# Altium schematic sheet Sheet4.SchDoc: Memory ICs
size B; DocumentNumber: 4; SheetNumber: 4; SheetTotal: 5
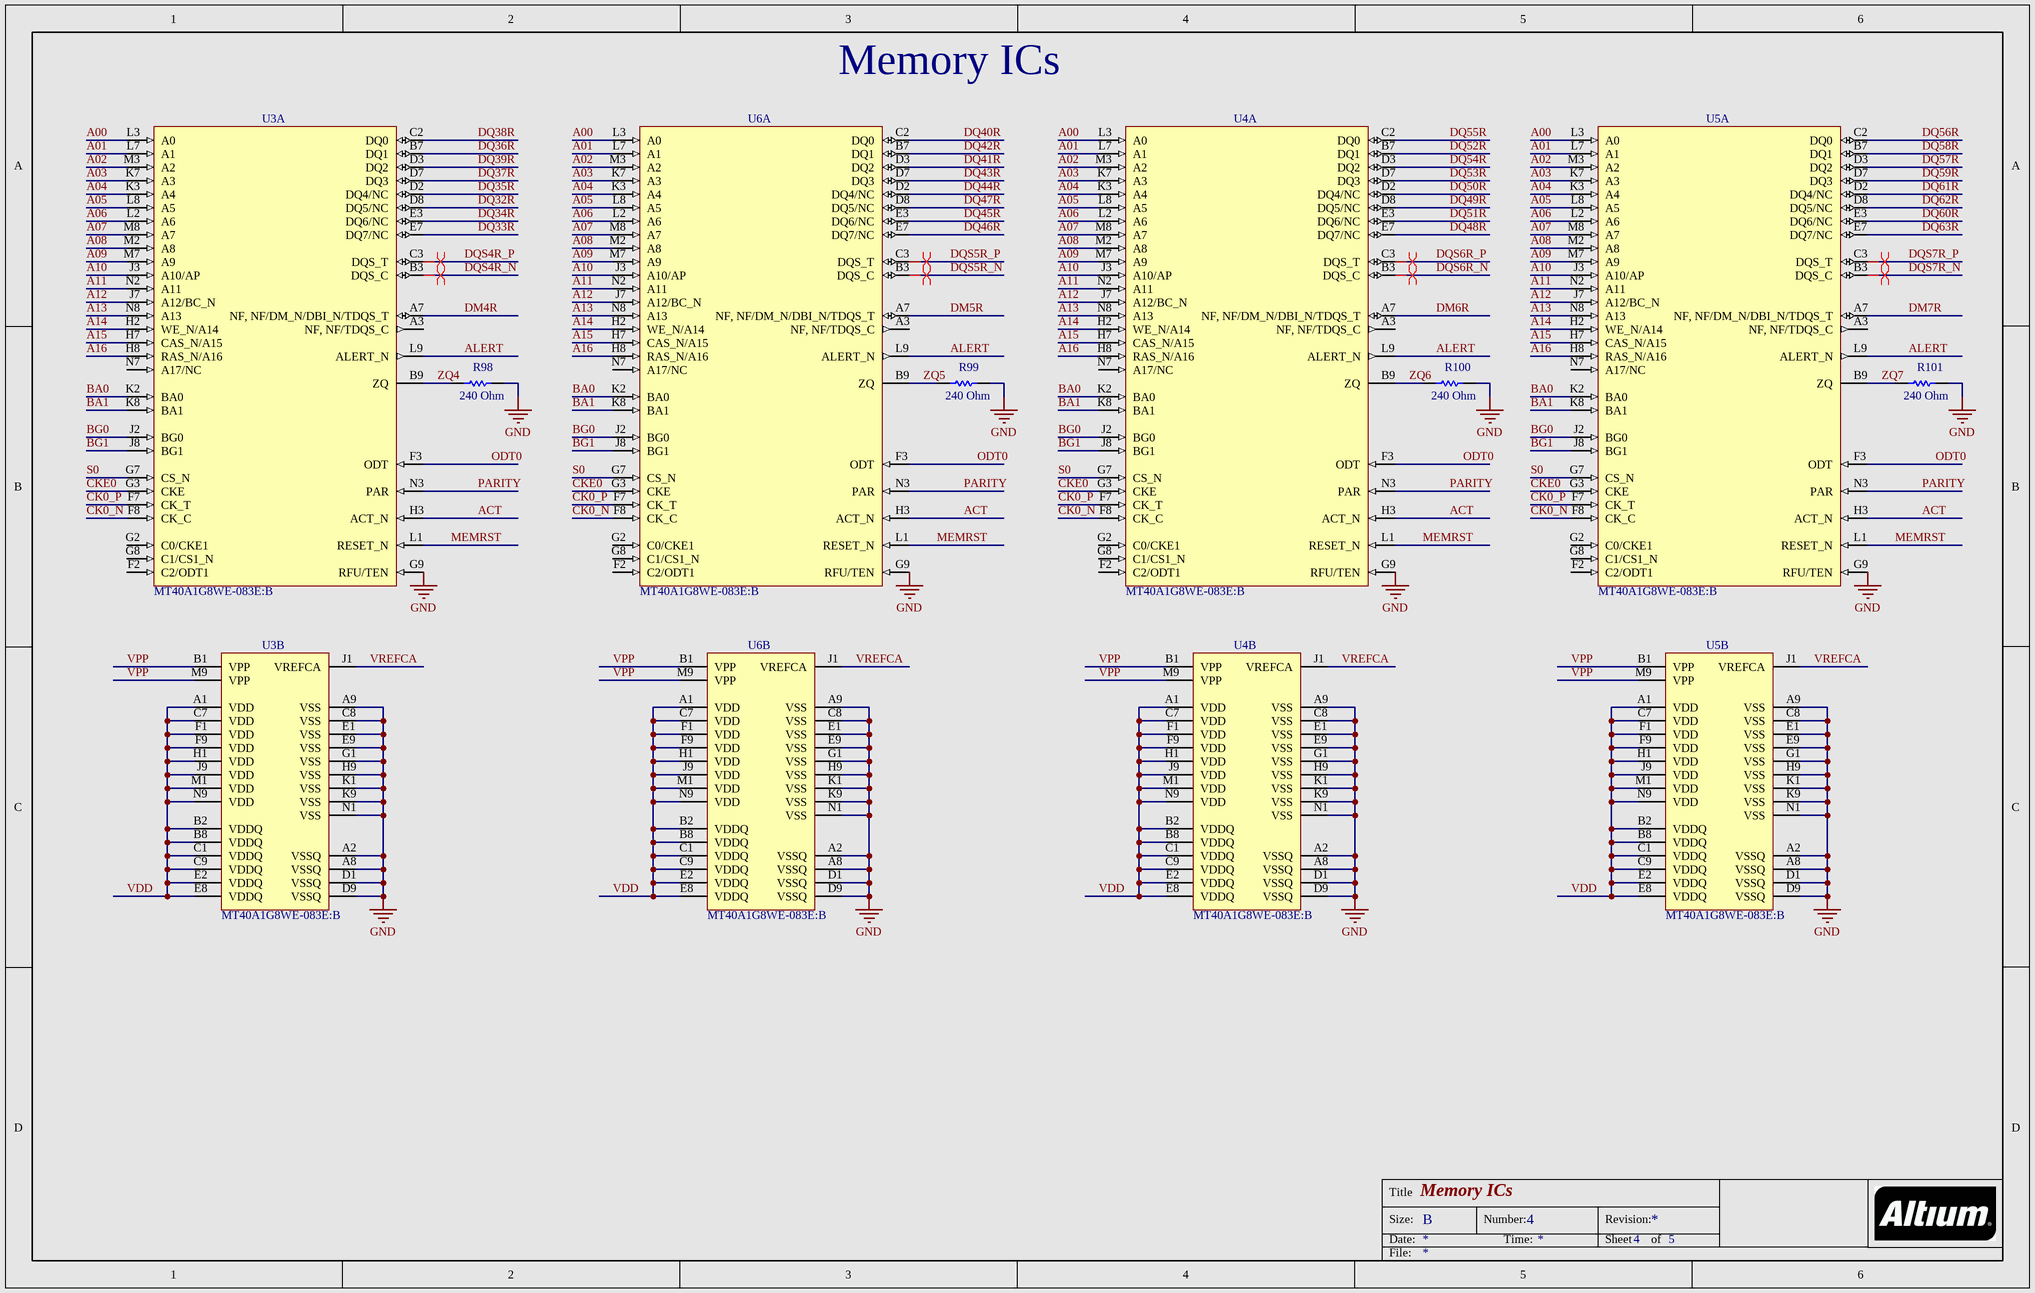
[diagram p0: Sheet4.SchDoc]

## Parts
R98  Resistance: 240 Ohm  [RESC1005X40X25ML05T05]  (hidden comment: ERJ-2GEJ241x)
R99  Resistance: 240 Ohm  [RESC1005X40X25ML05T05]  (hidden comment: ERJ-2GEJ241x)
R100  Resistance: 240 Ohm  [RESC1005X40X25ML05T05]  (hidden comment: ERJ-2GEJ241x)
R101  Resistance: 240 Ohm  [RESC1005X40X25ML05T05]  (hidden comment: ERJ-2GEJ241x)
U3  MT40A1G8WE-083E:B  [MICT-WE-78]  (parts A,B of 2)
U4  MT40A1G8WE-083E:B  [MICT-WE-78]  (parts A,B of 2)
U5  MT40A1G8WE-083E:B  [MICT-WE-78]  (parts A,B of 2)
U6  MT40A1G8WE-083E:B  [MICT-WE-78]  (parts A,B of 2)

## Nets
GND: R98.1 R99.1 R100.1 R101.1 U3.A2(VSSQ) U3.A8(VSSQ) U3.A9(VSS) U3.C8(VSS) U3.D1(VSSQ) U3.D9(VSSQ) U3.E1(VSS) U3.E9(VSS) U3.G1(VSS) U3.G9(RFU/TEN) U3.H9(VSS) U3.K1(VSS) U3.K9(VSS) U3.N1(VSS) U4.A2(VSSQ) U4.A8(VSSQ) U4.A9(VSS) U4.C8(VSS) U4.D1(VSSQ) U4.D9(VSSQ) U4.E1(VSS) U4.E9(VSS) U4.G1(VSS) U4.G9(RFU/TEN) U4.H9(VSS) U4.K1(VSS) U4.K9(VSS) U4.N1(VSS) U5.A2(VSSQ) U5.A8(VSSQ) U5.A9(VSS) U5.C8(VSS) U5.D1(VSSQ) U5.D9(VSSQ) U5.E1(VSS) U5.E9(VSS) U5.G1(VSS) U5.G9(RFU/TEN) U5.H9(VSS) U5.K1(VSS) U5.K9(VSS) U5.N1(VSS) U6.A2(VSSQ) U6.A8(VSSQ) U6.A9(VSS) U6.C8(VSS) U6.D1(VSSQ) U6.D9(VSSQ) U6.E1(VSS) U6.E9(VSS) U6.G1(VSS) U6.G9(RFU/TEN) U6.H9(VSS) U6.K1(VSS) U6.K9(VSS) U6.N1(VSS)
A00: U3.L3(A0) U4.L3(A0) U5.L3(A0) U6.L3(A0)
A01: U3.L7(A1) U4.L7(A1) U5.L7(A1) U6.L7(A1)
A02: U3.M3(A2) U4.M3(A2) U5.M3(A2) U6.M3(A2)
A03: U3.K7(A3) U4.K7(A3) U5.K7(A3) U6.K7(A3)
A04: U3.K3(A4) U4.K3(A4) U5.K3(A4) U6.K3(A4)
A05: U3.L8(A5) U4.L8(A5) U5.L8(A5) U6.L8(A5)
A06: U3.L2(A6) U4.L2(A6) U5.L2(A6) U6.L2(A6)
A07: U3.M8(A7) U4.M8(A7) U5.M8(A7) U6.M8(A7)
A08: U3.M2(A8) U4.M2(A8) U5.M2(A8) U6.M2(A8)
A09: U3.M7(A9) U4.M7(A9) U5.M7(A9) U6.M7(A9)
A10: U3.J3(A10/AP) U4.J3(A10/AP) U5.J3(A10/AP) U6.J3(A10/AP)
A11: U3.N2(A11) U4.N2(A11) U5.N2(A11) U6.N2(A11)
A12: U3.J7(A12/BC_N) U4.J7(A12/BC_N) U5.J7(A12/BC_N) U6.J7(A12/BC_N)
A13: U3.N8(A13) U4.N8(A13) U5.N8(A13) U6.N8(A13)
A14: U3.H2(WE_N/A14) U4.H2(WE_N/A14) U5.H2(WE_N/A14) U6.H2(WE_N/A14)
A15: U3.H7(CAS_N/A15) U4.H7(CAS_N/A15) U5.H7(CAS_N/A15) U6.H7(CAS_N/A15)
A16: U3.H8(RAS_N/A16) U4.H8(RAS_N/A16) U5.H8(RAS_N/A16) U6.H8(RAS_N/A16)
ACT: U3.H3(ACT_N) U4.H3(ACT_N) U5.H3(ACT_N) U6.H3(ACT_N)
ALERT: U3.L9(ALERT_N) U4.L9(ALERT_N) U5.L9(ALERT_N) U6.L9(ALERT_N)
BA0: U3.K2(BA0) U4.K2(BA0) U5.K2(BA0) U6.K2(BA0)
BA1: U3.K8(BA1) U4.K8(BA1) U5.K8(BA1) U6.K8(BA1)
BG0: U3.J2(BG0) U4.J2(BG0) U5.J2(BG0) U6.J2(BG0)
BG1: U3.J8(BG1) U4.J8(BG1) U5.J8(BG1) U6.J8(BG1)
CK0_N: U3.F8(CK_C) U4.F8(CK_C) U5.F8(CK_C) U6.F8(CK_C)
CK0_P: U3.F7(CK_T) U4.F7(CK_T) U5.F7(CK_T) U6.F7(CK_T)
CKE0: U3.G3(CKE) U4.G3(CKE) U5.G3(CKE) U6.G3(CKE)
DM4R: U3.A7(NF,_NF/DM_N/DBI_N/TDQS_T)
DM5R: U6.A7(NF,_NF/DM_N/DBI_N/TDQS_T)
DM6R: U4.A7(NF,_NF/DM_N/DBI_N/TDQS_T)
DM7R: U5.A7(NF,_NF/DM_N/DBI_N/TDQS_T)
DQ32R: U3.D8(DQ5/NC)
DQ33R: U3.E7(DQ7/NC)
DQ34R: U3.E3(DQ6/NC)
DQ35R: U3.D2(DQ4/NC)
DQ36R: U3.B7(DQ1)
DQ37R: U3.D7(DQ3)
DQ38R: U3.C2(DQ0)
DQ39R: U3.D3(DQ2)
DQ40R: U6.C2(DQ0)
DQ41R: U6.D3(DQ2)
DQ42R: U6.B7(DQ1)
DQ43R: U6.D7(DQ3)
DQ44R: U6.D2(DQ4/NC)
DQ45R: U6.E3(DQ6/NC)
DQ46R: U6.E7(DQ7/NC)
DQ47R: U6.D8(DQ5/NC)
DQ48R: U4.E7(DQ7/NC)
DQ49R: U4.D8(DQ5/NC)
DQ50R: U4.D2(DQ4/NC)
DQ51R: U4.E3(DQ6/NC)
DQ52R: U4.B7(DQ1)
DQ53R: U4.D7(DQ3)
DQ54R: U4.D3(DQ2)
DQ55R: U4.C2(DQ0)
DQ56R: U5.C2(DQ0)
DQ57R: U5.D3(DQ2)
DQ58R: U5.B7(DQ1)
DQ59R: U5.D7(DQ3)
DQ60R: U5.E3(DQ6/NC)
DQ61R: U5.D2(DQ4/NC)
DQ62R: U5.D8(DQ5/NC)
DQ63R: U5.E7(DQ7/NC)
DQS4R_N: U3.B3(DQS_C)
DQS4R_P: U3.C3(DQS_T)
DQS5R_N: U6.B3(DQS_C)
DQS5R_P: U6.C3(DQS_T)
DQS6R_N: U4.B3(DQS_C)
DQS6R_P: U4.C3(DQS_T)
DQS7R_N: U5.B3(DQS_C)
DQS7R_P: U5.C3(DQS_T)
MEMRST: U3.L1(RESET_N) U4.L1(RESET_N) U5.L1(RESET_N) U6.L1(RESET_N)
ODT0: U3.F3(ODT) U4.F3(ODT) U5.F3(ODT) U6.F3(ODT)
PARITY: U3.N3(PAR) U4.N3(PAR) U5.N3(PAR) U6.N3(PAR)
S0: U3.G7(CS_N) U4.G7(CS_N) U5.G7(CS_N) U6.G7(CS_N)
VDD: U3.A1(VDD) U3.B2(VDDQ) U3.B8(VDDQ) U3.C1(VDDQ) U3.C7(VDD) U3.C9(VDDQ) U3.E2(VDDQ) U3.E8(VDDQ) U3.F1(VDD) U3.F9(VDD) U3.H1(VDD) U3.J9(VDD) U3.M1(VDD) U3.N9(VDD) U4.A1(VDD) U4.B2(VDDQ) U4.B8(VDDQ) U4.C1(VDDQ) U4.C7(VDD) U4.C9(VDDQ) U4.E2(VDDQ) U4.E8(VDDQ) U4.F1(VDD) U4.F9(VDD) U4.H1(VDD) U4.J9(VDD) U4.M1(VDD) U4.N9(VDD) U5.A1(VDD) U5.B2(VDDQ) U5.B8(VDDQ) U5.C1(VDDQ) U5.C7(VDD) U5.C9(VDDQ) U5.E2(VDDQ) U5.E8(VDDQ) U5.F1(VDD) U5.F9(VDD) U5.H1(VDD) U5.J9(VDD) U5.M1(VDD) U5.N9(VDD) U6.A1(VDD) U6.B2(VDDQ) U6.B8(VDDQ) U6.C1(VDDQ) U6.C7(VDD) U6.C9(VDDQ) U6.E2(VDDQ) U6.E8(VDDQ) U6.F1(VDD) U6.F9(VDD) U6.H1(VDD) U6.J9(VDD) U6.M1(VDD) U6.N9(VDD)
VPP: U3.B1(VPP) U3.M9(VPP) U4.B1(VPP) U4.M9(VPP) U5.B1(VPP) U5.M9(VPP) U6.B1(VPP) U6.M9(VPP)
VREFCA: U3.J1(VREFCA) U4.J1(VREFCA) U5.J1(VREFCA) U6.J1(VREFCA)
ZQ4: R98.2 U3.B9(ZQ)
ZQ5: R99.2 U6.B9(ZQ)
ZQ6: R100.2 U4.B9(ZQ)
ZQ7: R101.2 U5.B9(ZQ)

Not connected (* = marked no-connect by the designer): U3 A3(NF,_NF/TDQS_C) F2(C2/ODT1) G2(C0/CKE1) G8(C1/CS1_N) N7(A17/NC); U4 A3(NF,_NF/TDQS_C) F2(C2/ODT1) G2(C0/CKE1) G8(C1/CS1_N) N7(A17/NC); U5 A3(NF,_NF/TDQS_C) F2(C2/ODT1) G2(C0/CKE1) G8(C1/CS1_N) N7(A17/NC); U6 A3(NF,_NF/TDQS_C) F2(C2/ODT1) G2(C0/CKE1) G8(C1/CS1_N) N7(A17/NC)

## Layout directives
differential pair: DQS4R_N, DQS4R_P, DQS5R_N, DQS5R_P, DQS6R_N, DQS6R_P, DQS7R_N, DQS7R_P

## Notes on the sheet
- Title
- Size:
- Date:
- B
- Number:
- Time:
- Revision:
- Sheet
- of
- File:

## Library data of the parts
R98-R101 = CMP-2002-00493-3: Chip Resistor, 240 Ohm, +/- 5%, 100 mW, -55 to 155 degC, 0402 (1005 Metric), RoHS, Tape and Reel; Manufacturer: Basic Passives; Voltage Rating: 50 V; Case\/Package: 0402; Power Rating: 100 mW; PackageReference: 0402; ComponentLink1URL: http://www.panasonic.com/; ComponentLink2Description: Datasheet; PackageDescription: 2-Pin Surface Mount Device, Body 1 x 0.5 mm; Tolerance: 5%; Radiation Hardening: No; Packaging: Tape and Reel; Case Code (Metric): 1005; PartNumber: ERJ-2GEJ241x; Case Code (Imperial): 0402; Mount: Surface Mount; REACH SVHC: Yes; Length: 1 mm; Mounting Technology: Surface Mount; Max Operating Temperature: 155 degC; Height: 0.35 mm; Width: 0.5 mm; Package Quantity: 10000; RoHSCompliant: true; DatasheetVersion: 03/2015; Pins: 2; ComponentLink1Description: Manufacturer URL; Min Operating Temperature: -55 degC; ComponentLink2URL: http://industrial.panasonic.com/cdbs/www-data/pdf/RDA0000/AOA0000C84.pdf
U3-U6 = CMP-1738-00001-1: 8 Gb DDR4 SDRAM, 1 Gig x 8, 1.2 V, 0 to 95 degC, 78-Ball FBGA (WE), RoHS; DatasheetVersion: Rev. E, 05/2016; ComponentLink2Description: Datasheet; ComponentLink2URL: https://www.micron.com/~/media/documents/products/data-sheet/dram/ddr4/8gb_ddr4_sdram.pdf; PartNumber: MT40A1G8WE-083E:B; PackageDescription: 78-Ball Ball Grid Array, Body 8 x 12 mm, Pitch 0.8 mm; ComponentLink1URL: http://www.micron.com/; ComponentLink1Description: Manufacturer URL; Mounting Technology: Surface Mount; PartId: 1